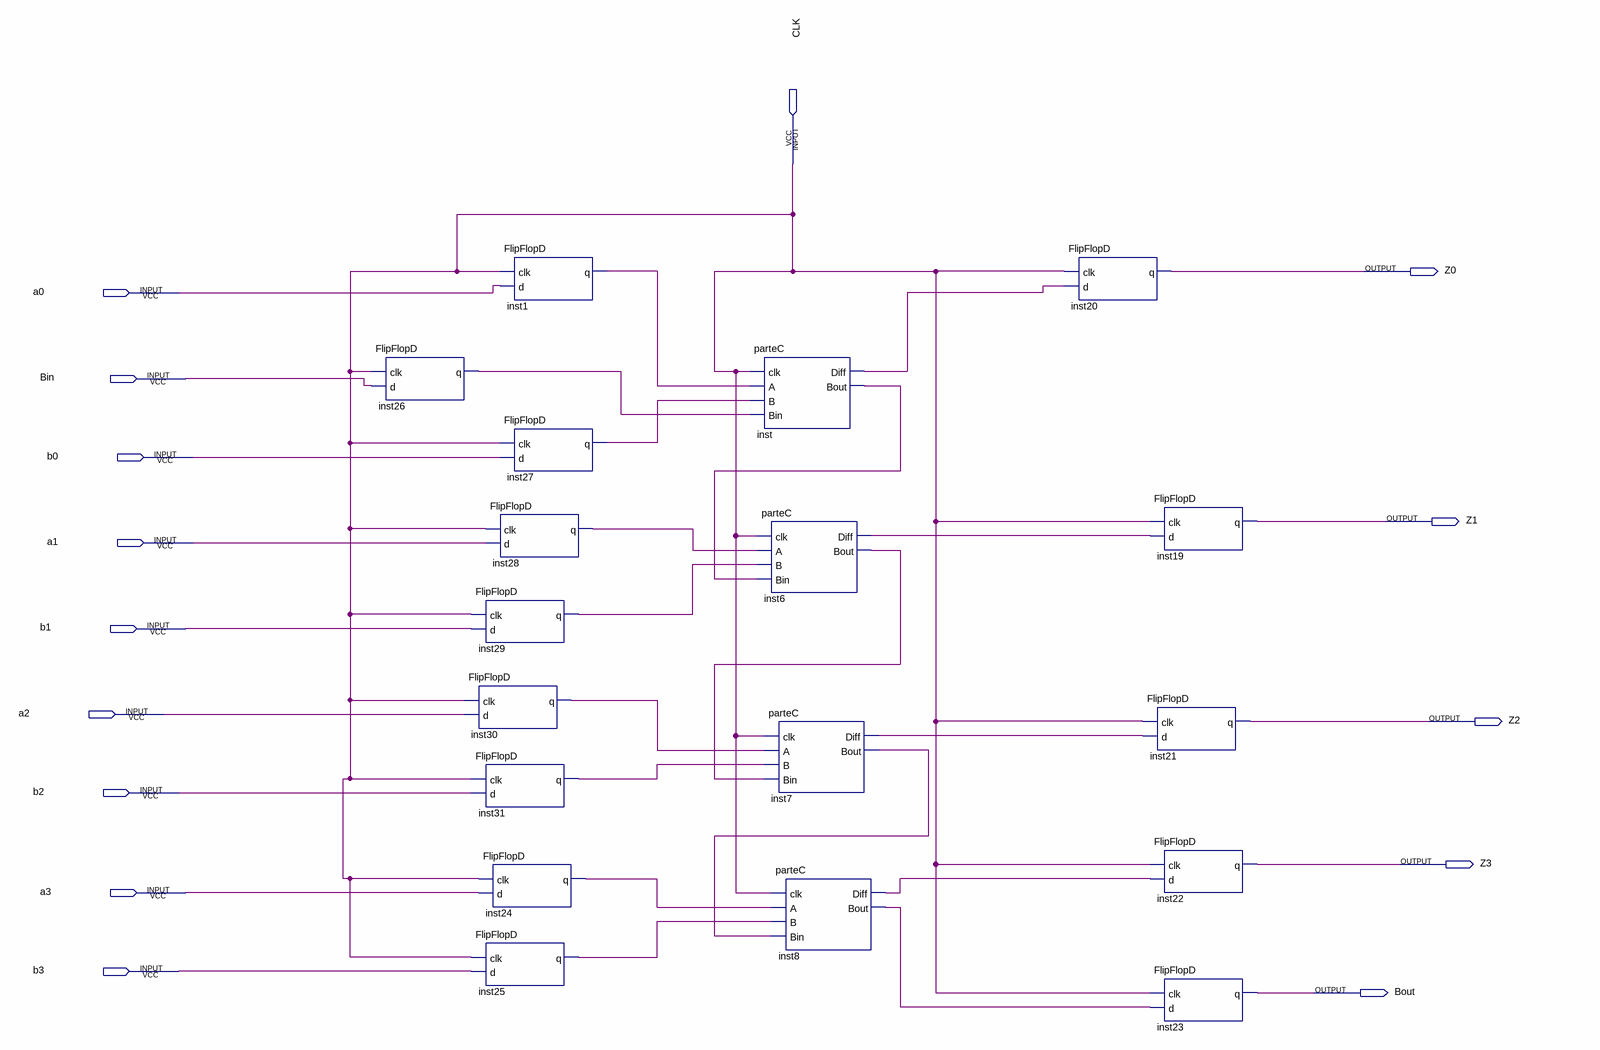
[diagram p0: schematic sheet]
// Quartus schematic Block1.bdf as structural Verilog: 18 symbols, 15 pins
module Block1 (
  input  CLK,
  input  a0,
  input  Bin,
  input  b0,
  input  a1,
  input  b1,
  input  a2,
  input  b2,
  input  a3,
  input  b3,
  output Z0,
  output Z1,
  output Z2,
  output Z3,
  output Bout
);

  wire inst1_q, inst6_bout, inst6_diff, inst7_bout, inst7_diff, inst8_bout, inst8_diff, inst24_q, inst25_q,
       inst26_q, inst27_q, inst28_q, inst29_q, inst30_q, inst31_q, inst_bout, inst_diff;

  FlipFlopD inst26 (.clk(CLK), .d(Bin), .q(inst26_q));
  FlipFlopD inst1 (.clk(CLK), .d(a0), .q(inst1_q));
  FlipFlopD inst27 (.clk(CLK), .d(b0), .q(inst27_q));
  FlipFlopD inst28 (.clk(CLK), .d(a1), .q(inst28_q));
  FlipFlopD inst29 (.clk(CLK), .d(b1), .q(inst29_q));
  FlipFlopD inst30 (.clk(CLK), .d(a2), .q(inst30_q));
  FlipFlopD inst31 (.clk(CLK), .d(b2), .q(inst31_q));
  FlipFlopD inst24 (.clk(CLK), .d(a3), .q(inst24_q));
  FlipFlopD inst25 (.clk(CLK), .d(b3), .q(inst25_q));
  parteC inst (.clk(CLK), .A(inst1_q), .B(inst27_q), .Bin(inst26_q), .Diff(inst_diff), .Bout(inst_bout));
  parteC inst6 (.clk(CLK), .A(inst28_q), .B(inst29_q), .Bin(inst_bout), .Diff(inst6_diff), .Bout(inst6_bout));
  parteC inst7 (.clk(CLK), .A(inst30_q), .B(inst31_q), .Bin(inst6_bout), .Diff(inst7_diff), .Bout(inst7_bout));
  parteC inst8 (.clk(CLK), .A(inst24_q), .B(inst25_q), .Bin(inst7_bout), .Diff(inst8_diff), .Bout(inst8_bout));
  FlipFlopD inst20 (.clk(CLK), .d(inst_diff), .q(Z0));
  FlipFlopD inst19 (.clk(CLK), .d(inst6_diff), .q(Z1));
  FlipFlopD inst21 (.clk(CLK), .d(inst7_diff), .q(Z2));
  FlipFlopD inst22 (.clk(CLK), .d(inst8_diff), .q(Z3));
  FlipFlopD inst23 (.clk(CLK), .d(inst8_bout), .q(Bout));
endmodule
